# EAGLE design BPW5035-TV-Video (EAGLE 5.11)
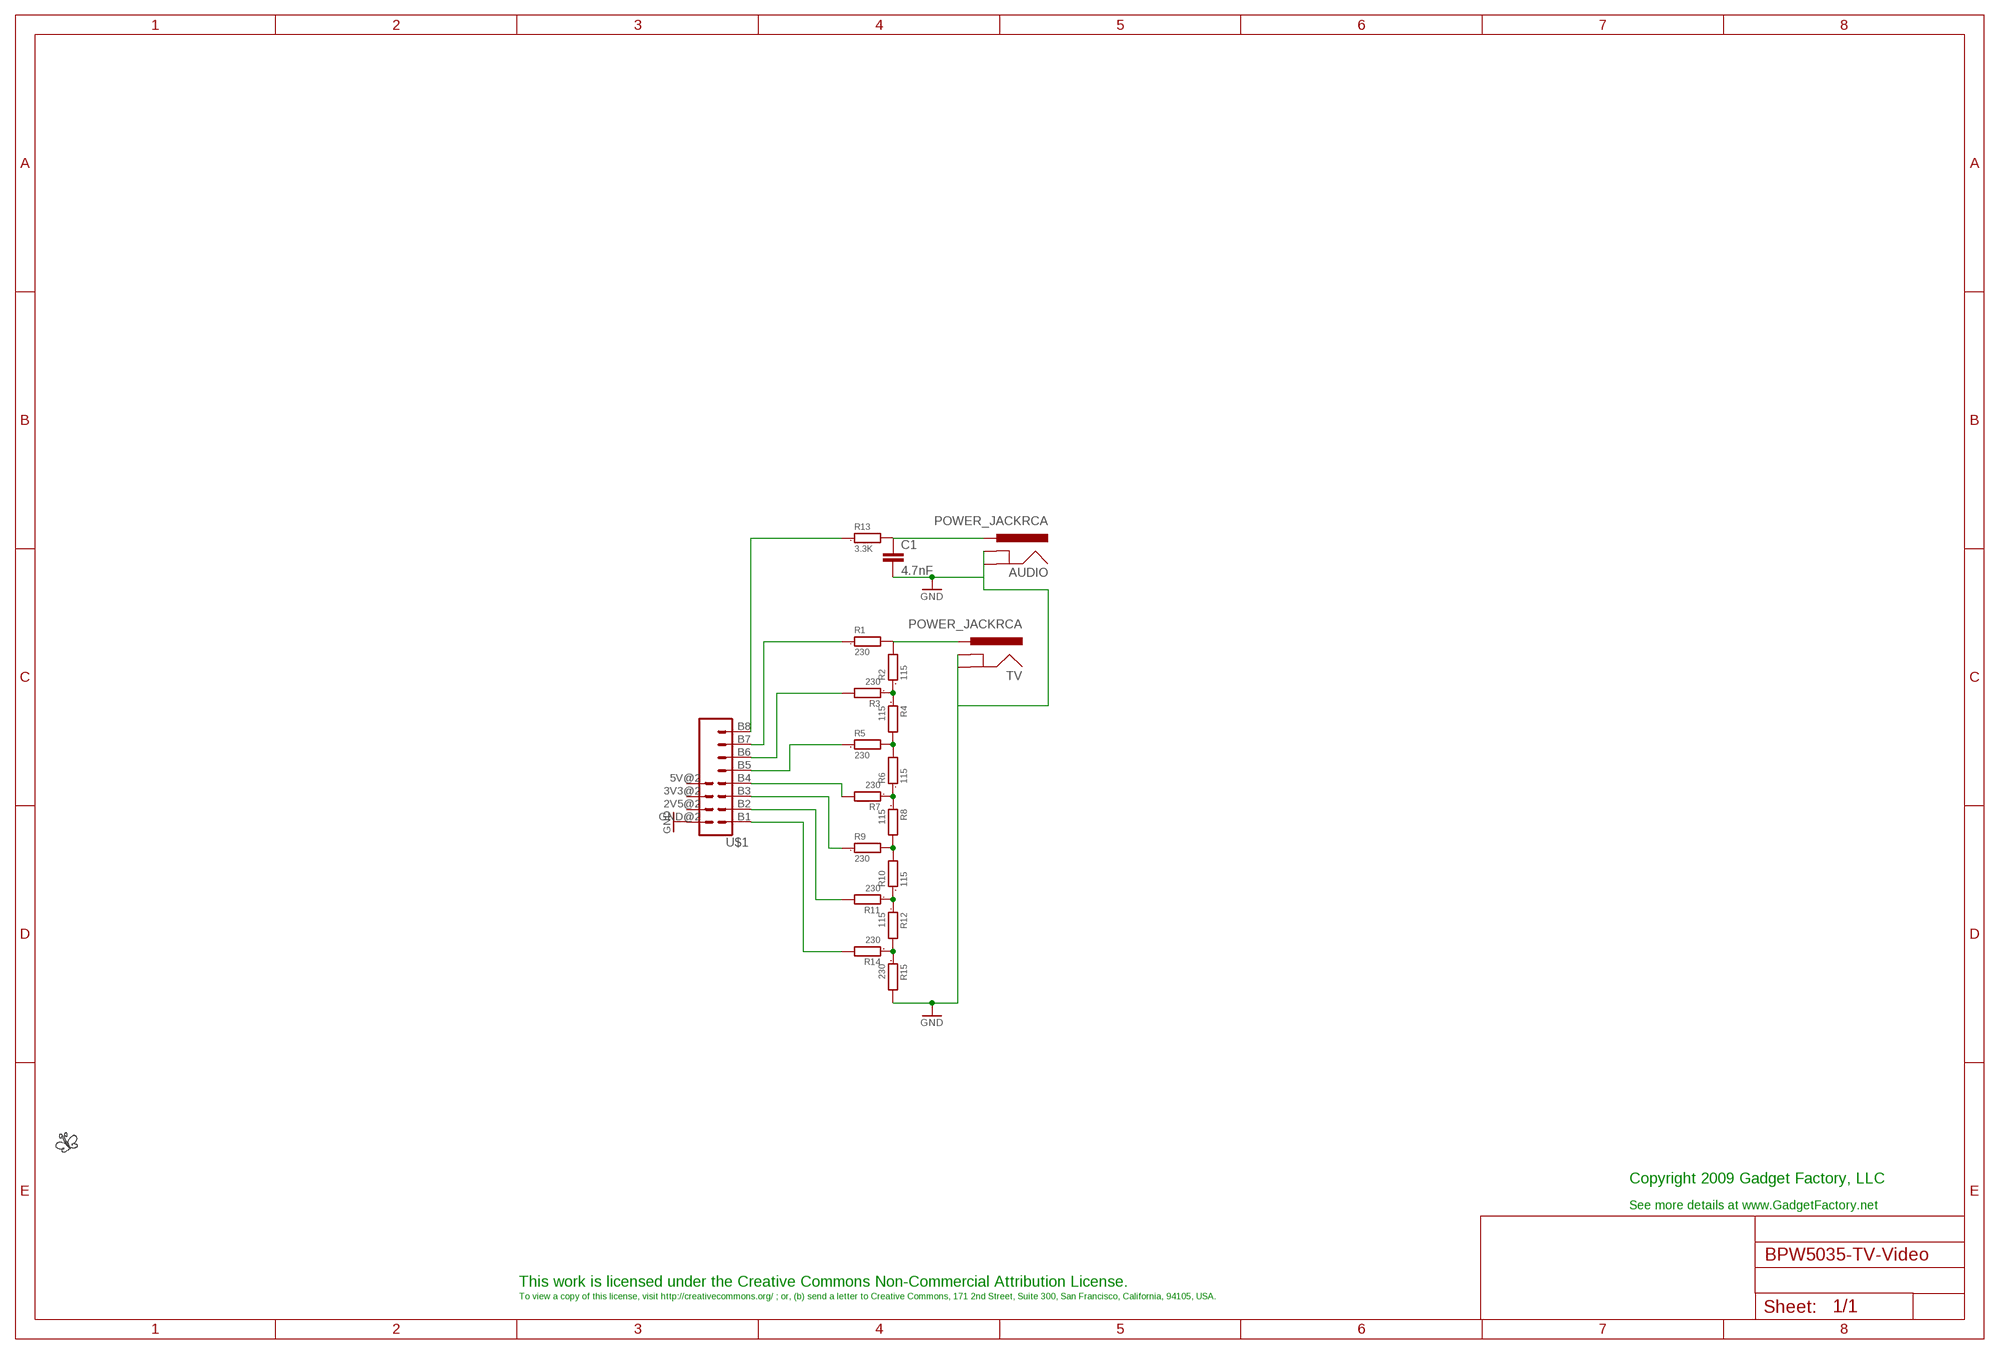
[diagram p0: schematic, sheet 1]

## Parts
AUDIO  POWER_JACKRCA  [RCA]
C1  4.7nF  C-EU050-025X075  [C050-025X075]
LOGO2  BUTTERFLY_LOGO  [BUTTERFLY_LOGO]
R1  230  R  [DUALRESISTOR]
R2  115  R  [DUALRESISTOR]
R3  230  R  [DUALRESISTOR]
R4  115  R  [DUALRESISTOR]
R5  230  R  [DUALRESISTOR]
R6  115  R  [DUALRESISTOR]
R7  230  R  [DUALRESISTOR]
R8  115  R  [DUALRESISTOR]
R9  230  R  [DUALRESISTOR]
R10  115  R  [DUALRESISTOR]
R11  230  R  [DUALRESISTOR]
R12  115  R  [DUALRESISTOR]
R13  3.3K  R  [DUALRESISTOR]
R14  230  R  [DUALRESISTOR]
R15  230  R  [DUALRESISTOR]
TV  POWER_JACKRCA  [RCA]
U$1  WING_8BIT  [WINGSIDE_8BIT]

## Nets
GND: AUDIO.BARREL(GND) AUDIO.SPRING(GNDBREAK) C1.2 R15.2 TV.BARREL(GND) TV.SPRING(GNDBREAK) U$1.GND@2(GND)
N$1: R1.2 R2.2 TV.BREAK(PWR)
N$2: R2.1 R3.1 R4.1
N$3: R4.2 R5.2 R6.2
N$4: R6.1 R7.1 R8.1
N$5: R8.2 R9.2 R10.2
N$6: R10.1 R11.1 R12.1
N$7: AUDIO.BREAK(PWR) C1.1 R13.2
N$8: R13.1 U$1.B8
N$9: R1.1 U$1.B7
N$10: R3.2 U$1.B6
N$11: R5.1 U$1.B5
N$12: R7.2 U$1.B4
N$13: R9.1 U$1.B3
N$14: R11.2 U$1.B2
N$16: R14.2 U$1.B1
N$17: R12.2 R14.1 R15.1
Unconnected: U$1.2V5@2(2V5) U$1.3V3@2(3V3) U$1.5V@2(5V)

## Notes on the sheet
- Copyright 2009 Gadget Factory, LLC
- See more details at www.GadgetFactory.net
- This work is licensed under the Creative Commons Non-Commercial Attribution License.
- To view a copy of this license, visit http://creativecommons.org/ ; or, (b) send a letter to Creative Commons, 171 2nd Street, Suite 300, San Francisco, California, 94105, USA.

## Library data of the parts
AUDIO TV = SparkFun:POWER_JACK: Power Jack This is the standard 5.5mm barrel jack for power. The PTH is the most common, proven, reliable, footprint. All others are experimental. The Slot footprint only works if the mill layer is transmitted to the PCB fab house so be warned. Spark Fun Electronics SKU : PRT-00119. Mating wall wart : TOL-00298 (and others)
C1 = rcl:C-EU: CAPACITOR, European symbol
LOGO2 = GadgetFactory_Pub:BUTTERFLY_LOGO
R1-R15 = GadgetFactory:R: RESISTOR, European symbol
U$1 = GadgetFactory_Pub:WING_8BIT

## Board
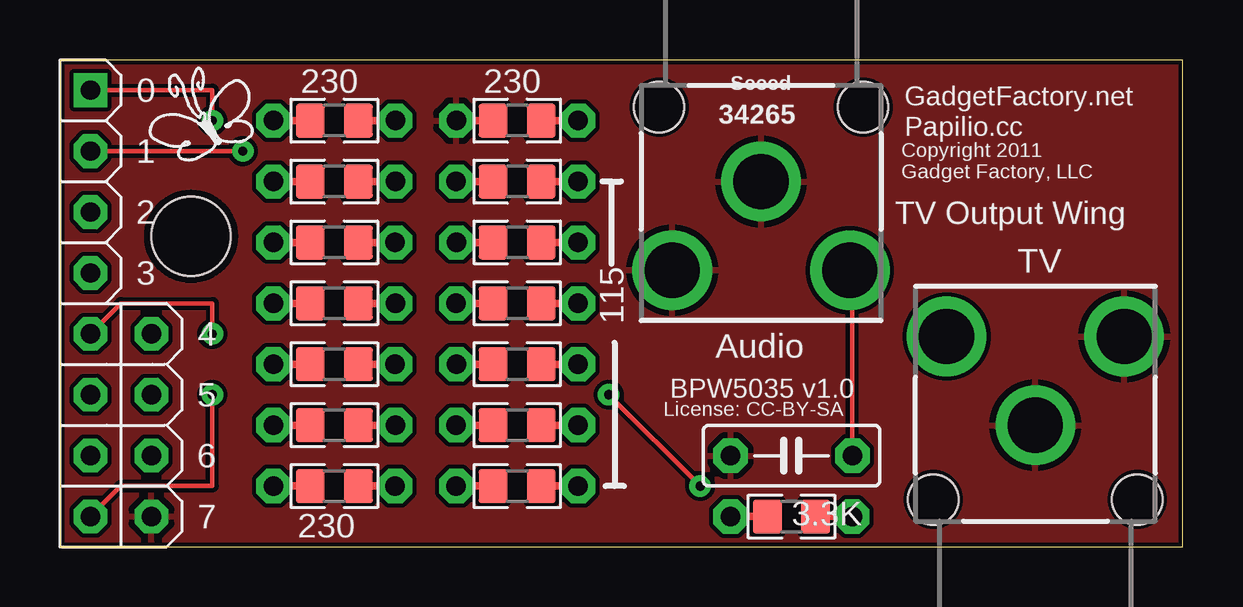
[diagram p1: board, top side]
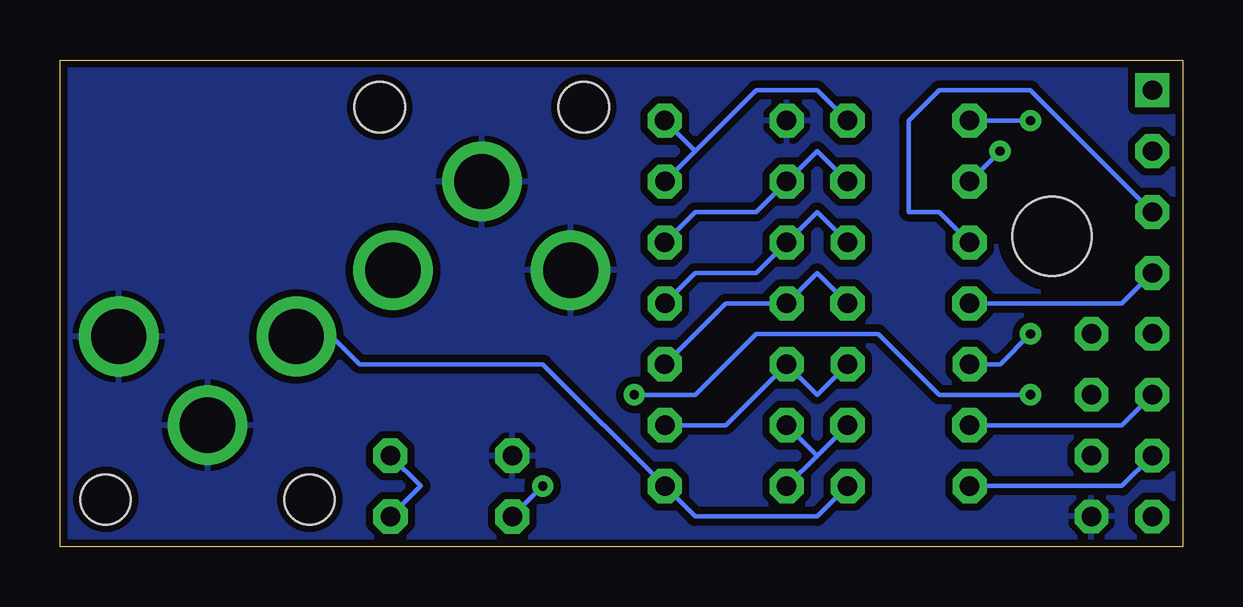
[diagram p2: board, bottom side, seen from below]

Size 46.79 x 20.31 mm. Coordinates in mm from the lower left corner, seen from the top.
Outline: 0,0 46.79,0 46.79,20.31 0,20.31 0,0
Copper layers (1*16): Top 0.035mm / dielectric 1.5mm / Bottom 0.035mm
Design rules "SparkFun_Derived_GoldePheonix_7mil": minimum track width 7mil, minimum drill 15mil, track to track 7mil, track to pad 7mil, pad to pad 7mil, via to via 7mil, smd to smd 7mil, copper to edge 7mil, drill to drill 7mil, minimum pad ring 12mil, minimum via ring 10mil, stop-mask expansion 4mil, vias tented up to drill 18mil, thermal gap 10mil

### Footprints (pad centres in the part's own frame; a part is rotated, then mirrored left to right if it is on the bottom)
RCA = drill 2.3 round: BARREL 0,0; BREAK 3.7,3.7; SPRING 3.7,-3.7 | hole 2.1: -3.1,4.25; -3.1,-4.25
C050-025X075 = drill 0.813 octagon: 1 -2.54,0; 2 2.54,0
DUALRESISTOR = drill 0.813 octagon: 1 -2.543,0; 2 2.537,0 | smd 1.2 x 1.4: 3 -1,0; 4 1,0
WINGSIDE_8BIT = drill 0.8 octagon: 2V5@2 16.51,3.81; 3V3@2 13.97,3.81; 5V@2 11.43,3.81; B2 3.81,1.27; B3 6.35,1.27; B4 8.89,1.27; B5 11.43,1.27; B6 13.97,1.27; B7 16.51,1.27; B8 19.05,1.27; GND@2 19.05,3.81 | drill 0.8 square: B1 1.27,1.27 | hole 3.302: 7.366,5.461

### Placement (x,y rotation side)
AUDIO  29.21,15.24 270 top
C1  30.48,3.81 180 top
LOGO2  5.97,17.53 0 top
R1  11.43,2.54 0 top
R2  19.05,2.54 0 top
R3  11.43,5.08 180 top
R4  19.05,5.08 0 top
R5  11.43,7.62 0 top
R6  19.05,7.62 180 top
R7  11.43,10.16 180 top
R8  19.05,10.16 0 top
R9  11.43,12.7 0 top
R10  19.05,12.7 180 top
R11  11.43,15.24 180 top
R12  19.05,15.24 0 top
R13  30.48,1.27 0 top
R14  11.43,17.78 180 top
R15  19.05,17.78 180 top
TV  40.64,5.08 90 top
U$1  0,20.32 270 top

### Tracks (layer width: path | path; a pad name or v marks a point on that pad's centre or on a via)
GND
  pour Bottom (isolate 0.305): 0,20.32 46.99,20.32 46.99,0 0,0
  pour Top: 0,20.32 46.99,20.32 46.99,0 0,0
N$1
  Bottom 0.178: R2.2 20.32,1.27 15.24,1.27 R1.2 | R2.2 26.67,7.62 34.29,7.62 35.56,8.89 36.83,8.89 TV.BREAK | R2.2
N$2
  Bottom 0.178: 15.24,3.81 R2.1 | 15.24,3.81 R3.1 | 15.24,3.81 R4.1
N$3
  Bottom 0.178: R6.2 15.24,6.35 R5.2 | R6.2 19.05,5.08 R4.2 | R6.2
N$4
  Bottom 0.178: R8.1 15.24,11.43 R7.1 | R8.1 19.05,10.16 R6.1 | R8.1
N$5
  Bottom 0.178: R10.2 15.24,13.97 R9.2 | R10.2 17.78,11.43 20.32,11.43 R8.2 | R10.2
N$6
  Bottom 0.178: R12.1 15.24,16.51 R11.1 | R12.1 17.78,13.97 20.32,13.97 R10.1 | R12.1
N$7
  Top 0.178: C1.1 33.02,11.43 AUDIO.BREAK
  Bottom 0.178: C1.1 31.75,2.54 R13.2
N$8  (via drill 0.38)
  Top 0.178: U$1.B8 2.54,2.54 6.35,2.54 v6.35,6.35 | v22.86,6.35 v26.67,2.54
  Bottom 0.178: v6.35,6.35 10.16,6.35 12.7,8.89 17.78,8.89 20.32,6.35 v22.86,6.35 | v26.67,2.54 R13.1
N$9
  Bottom 0.178: U$1.B7 2.54,2.54 R1.1
N$10
  Bottom 0.178: U$1.B6 2.54,5.08 R3.2
N$11  (via drill 0.38)
  Top 0.178: U$1.B5 2.54,10.16 6.35,10.16 v6.35,8.89
  Bottom 0.178: v6.35,8.89 7.62,7.62 R5.1
N$12
  Bottom 0.178: U$1.B4 2.54,10.16 R7.2
N$13
  Bottom 0.178: U$1.B3 6.35,19.05 10.16,19.05 11.43,17.78 11.43,13.97 10.16,13.97 R9.1
N$14  (via drill 0.38)
  Top 0.178: U$1.B2 v7.62,16.51
  Bottom 0.178: v7.62,16.51 R11.2
N$16  (via drill 0.38)
  Top 0.178: U$1.B1 6.35,19.05 v6.35,17.78
  Bottom 0.178: v6.35,17.78 R14.2
N$17
  Bottom 0.178: 20.32,16.51 R12.2 | 20.32,16.51 R15.1 | 20.32,16.51 17.78,19.05 15.24,19.05 R14.1

### Text on the board
tPlace: 0 | 230 | 230 | GadgetFactory.net | Papilio.cc | 1 | Copyright 2011 | Gadget Factory, LLC | 2 | TV Output Wing | 115 | 3 | TV | 4 | Audio | 5 | BPW5035 v1.0 | License: CC-BY-SA | 6 | 7 | 3.3K | 230
tNames: Seeed | 34265